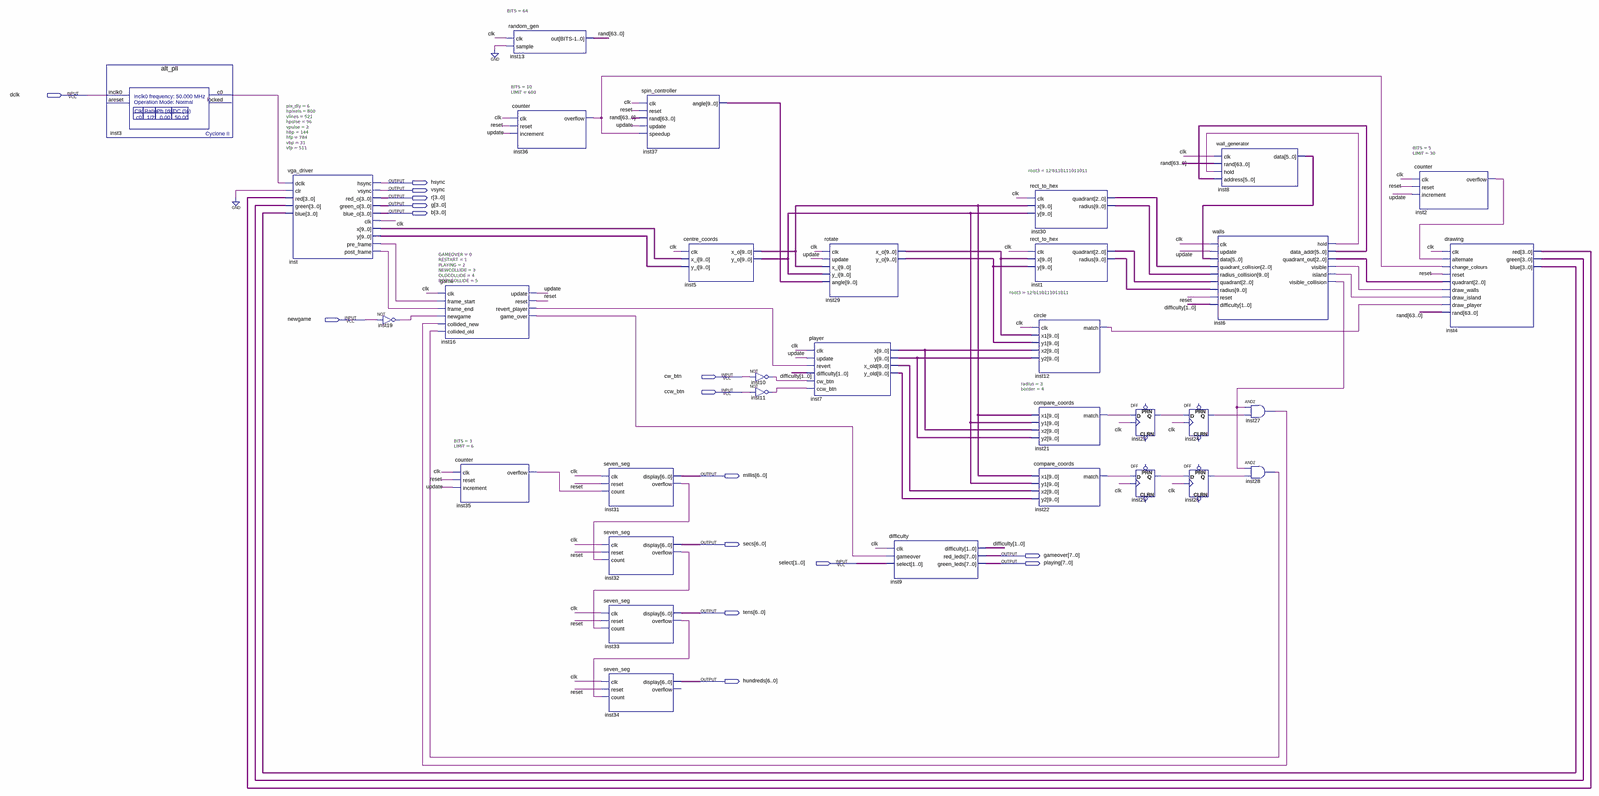
[diagram p0: schematic sheet, whole]
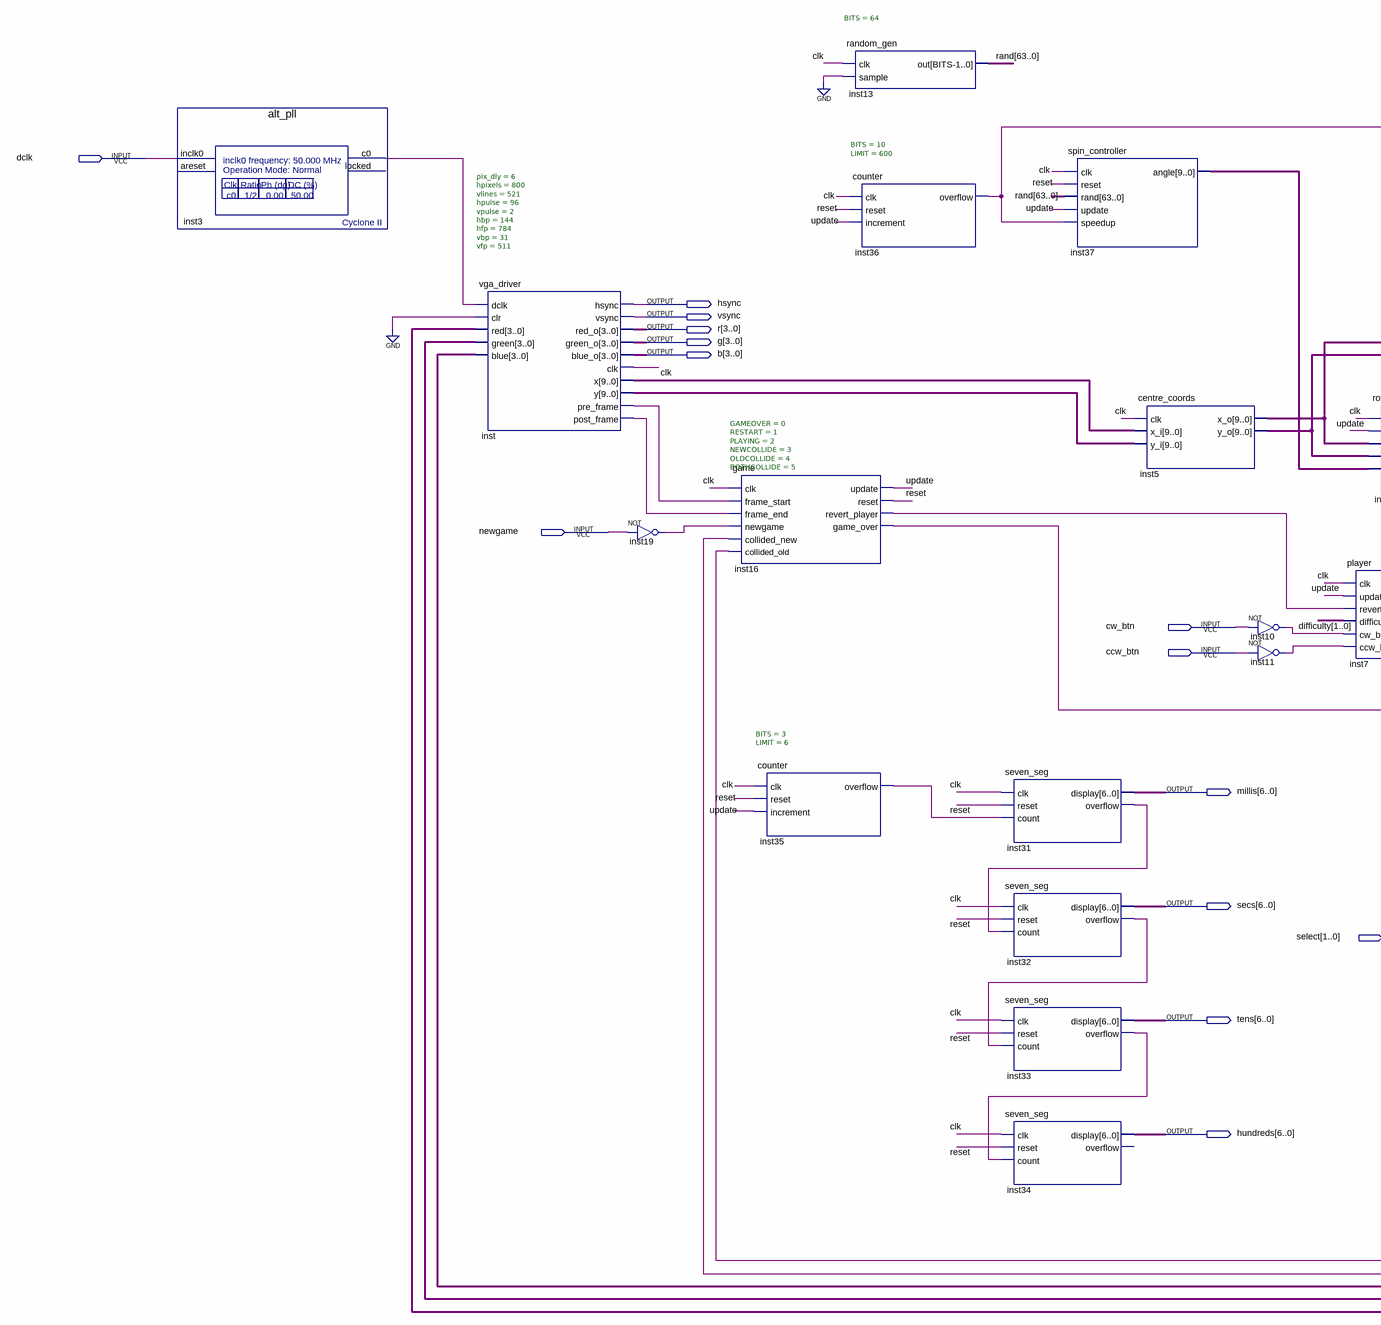
[diagram p1: schematic sheet, left part]
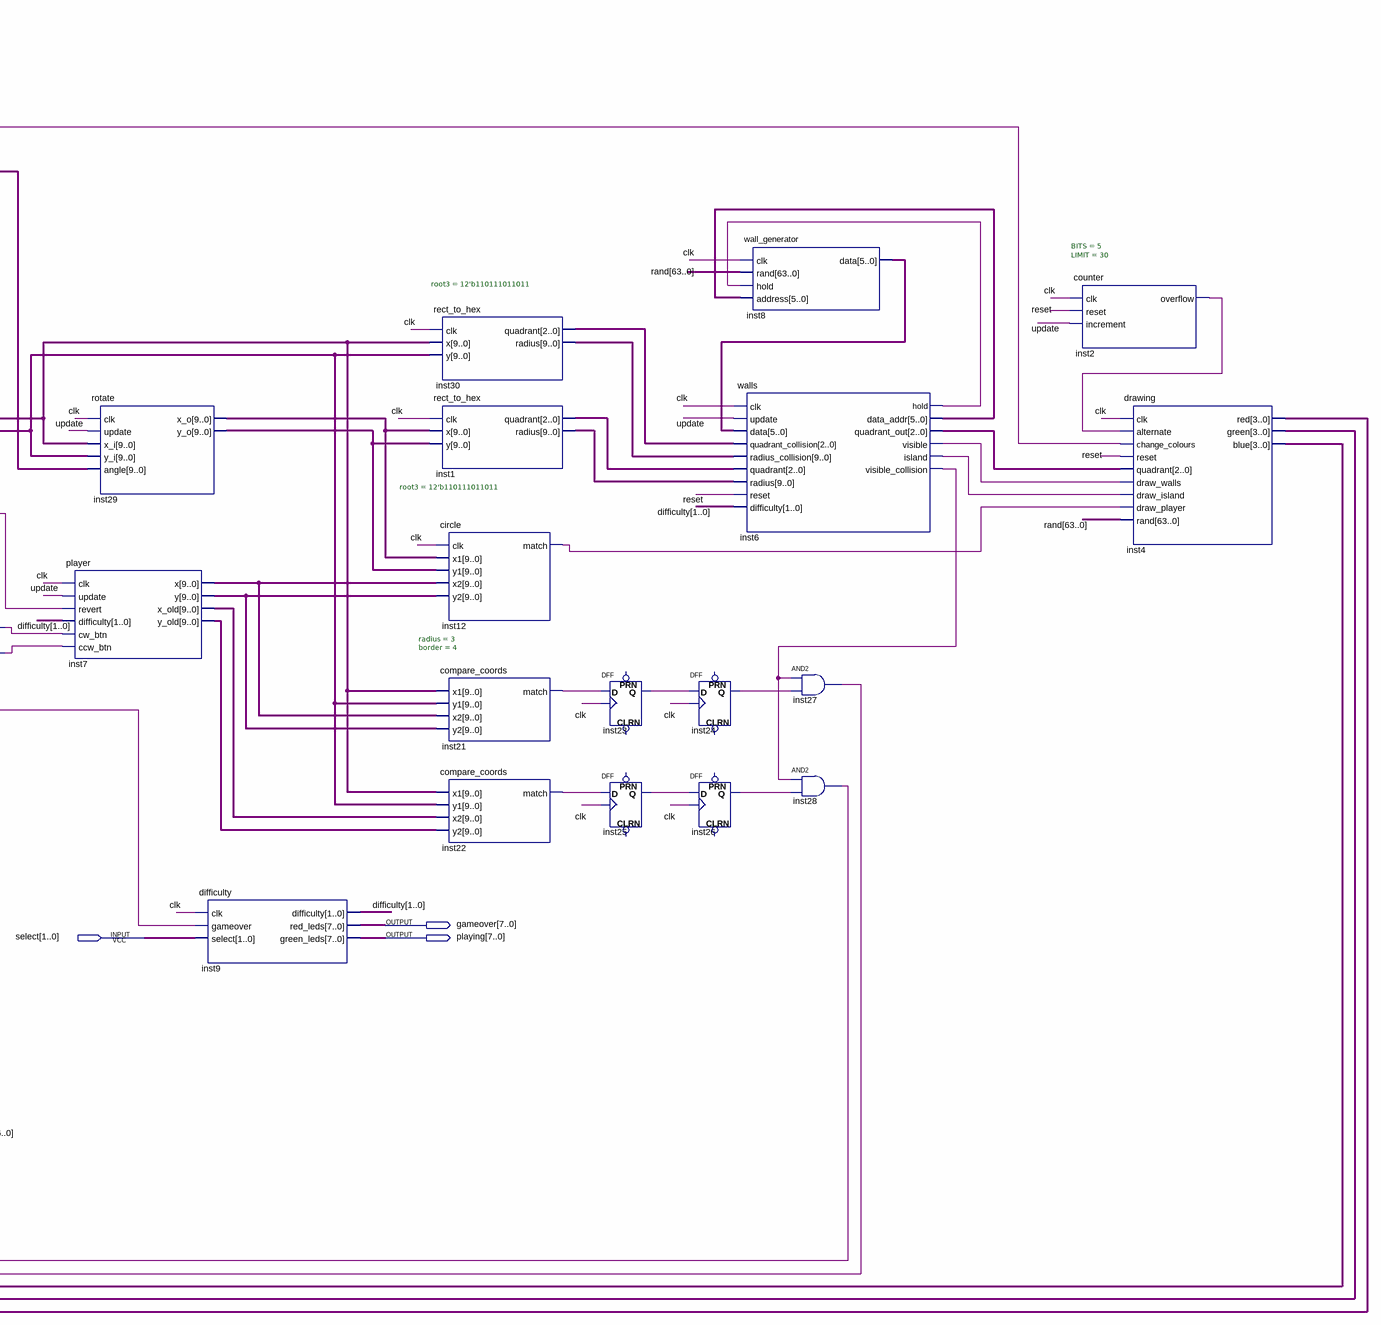
[diagram p2: schematic sheet, right part]
// Quartus schematic SuperHexagon.bdf as structural Verilog: 33 symbols, 16 pins
module SuperHexagon (
  input  dclk,
  input  newgame,
  input  cw_btn,
  input  ccw_btn,
  input  [1:0] select,
  output hsync,
  output vsync,
  output [3:0] r,
  output [3:0] g,
  output [3:0] b,
  output [6:0] millis,
  output [6:0] secs,
  output [7:0] gameover,
  output [7:0] playing,
  output [6:0] tens,
  output [6:0] hundreds
);

  wire clk, inst2_overflow, inst3_c0, inst6_hold, inst6_island, inst6_visible, inst6_visible_collision,
       inst10_out, inst11_out, inst12_match, inst16_game_over, inst16_revert_player, inst19_out,
       inst21_match, inst22_match, inst23_q, inst24_q, inst25_q, inst26_q, inst27_out, inst28_out,
       inst31_overflow, inst32_overflow, inst33_overflow, inst35_overflow, inst36_overflow, inst_post_frame,
       inst_pre_frame, reset, update;
  wire [1:0] difficulty;
  wire [2:0] inst1_quadrant, inst6_quadrant_out, inst30_quadrant;
  wire [3:0] inst4_blue, inst4_green, inst4_red;
  wire [5:0] inst6_data_addr, inst8_data;
  wire [9:0] inst1_radius, inst5_x_o, inst5_y_o, inst7_x, inst7_x_old, inst7_y, inst7_y_old, inst29_x_o,
       inst29_y_o, inst30_radius, inst37_angle, inst_x, inst_y;
  wire [63:0] \rand ;

  alt_pll inst3 (.inclk0(dclk), .c0(inst3_c0));  // open: areset, locked
  vga_driver #(.pix_dly(6), .hpixels(800), .vlines(521), .hpulse(96), .vpulse(2), .hbp(144), .hfp(784), .vbp(31), .vfp(511)) inst (
    .dclk(inst3_c0), .clr(1'b0), .red(inst4_red), .green(inst4_green), .blue(inst4_blue), .hsync(hsync),
    .vsync(vsync), .red_o(r), .green_o(g), .blue_o(b), .clk(clk), .x(inst_x), .y(inst_y),
    .pre_frame(inst_pre_frame), .post_frame(inst_post_frame));
  not inst19 (inst19_out, newgame);
  game #(.GAMEOVER(0), .RESTART(1), .PLAYING(2), .NEWCOLLIDE(3), .OLDCOLLIDE(4), .BOTHCOLLIDE(5)) inst16 (
    .clk(clk), .frame_start(inst_pre_frame), .frame_end(inst_post_frame), .newgame(inst19_out),
    .collided_new(inst27_out), .collided_old(inst28_out), .update(update), .reset(reset),
    .revert_player(inst16_revert_player), .game_over(inst16_game_over));
  counter #(.BITS(3), .LIMIT(6)) inst35 (.clk(clk), .reset(reset), .increment(update), .overflow(inst35_overflow));
  random_gen #(.BITS(64)) inst13 (.clk(clk), .sample(1'b0), .out(\rand ));
  counter #(.BITS(10), .LIMIT(600)) inst36 (.clk(clk), .reset(reset), .increment(update), .overflow(inst36_overflow));
  seven_seg inst31 (.clk(clk), .reset(reset), .count(inst35_overflow), .display(millis), .overflow(inst31_overflow));
  seven_seg inst32 (.clk(clk), .reset(reset), .count(inst31_overflow), .display(secs), .overflow(inst32_overflow));
  seven_seg inst33 (.clk(clk), .reset(reset), .count(inst32_overflow), .display(tens), .overflow(inst33_overflow));
  seven_seg inst34 (.clk(clk), .reset(reset), .count(inst33_overflow), .display(hundreds));  // open: overflow
  spin_controller inst37 (
    .clk(clk), .reset(reset), .\rand (\rand ), .update(update), .speedup(inst36_overflow),
    .angle(inst37_angle));
  centre_coords inst5 (.clk(clk), .x_i(inst_x), .y_i(inst_y), .x_o(inst5_x_o), .y_o(inst5_y_o));
  not inst10 (inst10_out, cw_btn);
  not inst11 (inst11_out, ccw_btn);
  player inst7 (
    .clk(clk), .update(update), .revert(inst16_revert_player), .difficulty(difficulty), .cw_btn(inst10_out),
    .ccw_btn(inst11_out), .x(inst7_x), .y(inst7_y), .x_old(inst7_x_old), .y_old(inst7_y_old));
  rotate inst29 (
    .clk(clk), .update(update), .x_i(inst5_x_o), .y_i(inst5_y_o), .angle(inst37_angle), .x_o(inst29_x_o),
    .y_o(inst29_y_o));
  difficulty inst9 (
    .clk(clk), .gameover(inst16_game_over), .select(select), .difficulty(difficulty), .red_leds(gameover),
    .green_leds(playing));
  rect_to_hex #(.root3(12'b110111011011)) inst30 (
    .clk(clk), .x(inst5_x_o), .y(inst5_y_o), .quadrant(inst30_quadrant), .radius(inst30_radius));
  rect_to_hex #(.root3(12'b110111011011)) inst1 (
    .clk(clk), .x(inst29_x_o), .y(inst29_y_o), .quadrant(inst1_quadrant), .radius(inst1_radius));
  circle #(.radius(3), .border(4)) inst12 (
    .clk(clk), .x1(inst29_x_o), .y1(inst29_y_o), .x2(inst7_x), .y2(inst7_y), .match(inst12_match));
  compare_coords inst21 (.x1(inst5_x_o), .y1(inst5_y_o), .x2(inst7_x), .y2(inst7_y), .match(inst21_match));
  compare_coords inst22 (.x1(inst5_x_o), .y1(inst5_y_o), .x2(inst7_x_old), .y2(inst7_y_old), .match(inst22_match));
  DFF inst23 (.CLK(clk), .D(inst21_match), .Q(inst23_q));  // open: CLRN, PRN
  DFF inst25 (.CLK(clk), .D(inst22_match), .Q(inst25_q));  // open: CLRN, PRN
  walls inst6 (
    .clk(clk), .update(update), .data(inst8_data), .quadrant_collision(inst30_quadrant),
    .radius_collision(inst30_radius), .quadrant(inst1_quadrant), .radius(inst1_radius), .reset(reset),
    .difficulty(difficulty), .hold(inst6_hold), .data_addr(inst6_data_addr),
    .quadrant_out(inst6_quadrant_out), .visible(inst6_visible), .island(inst6_island),
    .visible_collision(inst6_visible_collision));
  DFF inst24 (.CLK(clk), .D(inst23_q), .Q(inst24_q));  // open: CLRN, PRN
  DFF inst26 (.CLK(clk), .D(inst25_q), .Q(inst26_q));  // open: CLRN, PRN
  wall_generator inst8 (.clk(clk), .\rand (\rand ), .hold(inst6_hold), .address(inst6_data_addr), .data(inst8_data));
  and inst27 (inst27_out, inst6_visible_collision, inst24_q);
  and inst28 (inst28_out, inst6_visible_collision, inst26_q);
  counter #(.BITS(5), .LIMIT(30)) inst2 (.clk(clk), .reset(reset), .increment(update), .overflow(inst2_overflow));
  drawing inst4 (
    .clk(clk), .alternate(inst2_overflow), .change_colours(inst36_overflow), .reset(reset),
    .quadrant(inst6_quadrant_out), .draw_walls(inst6_visible), .draw_island(inst6_island),
    .draw_player(inst12_match), .\rand (\rand ), .red(inst4_red), .green(inst4_green), .blue(inst4_blue));
endmodule
